# Altium schematic sheet ADC.SchDoc
size A4; DocumentNumber: 3; SheetNumber: 3; SheetTotal: 4
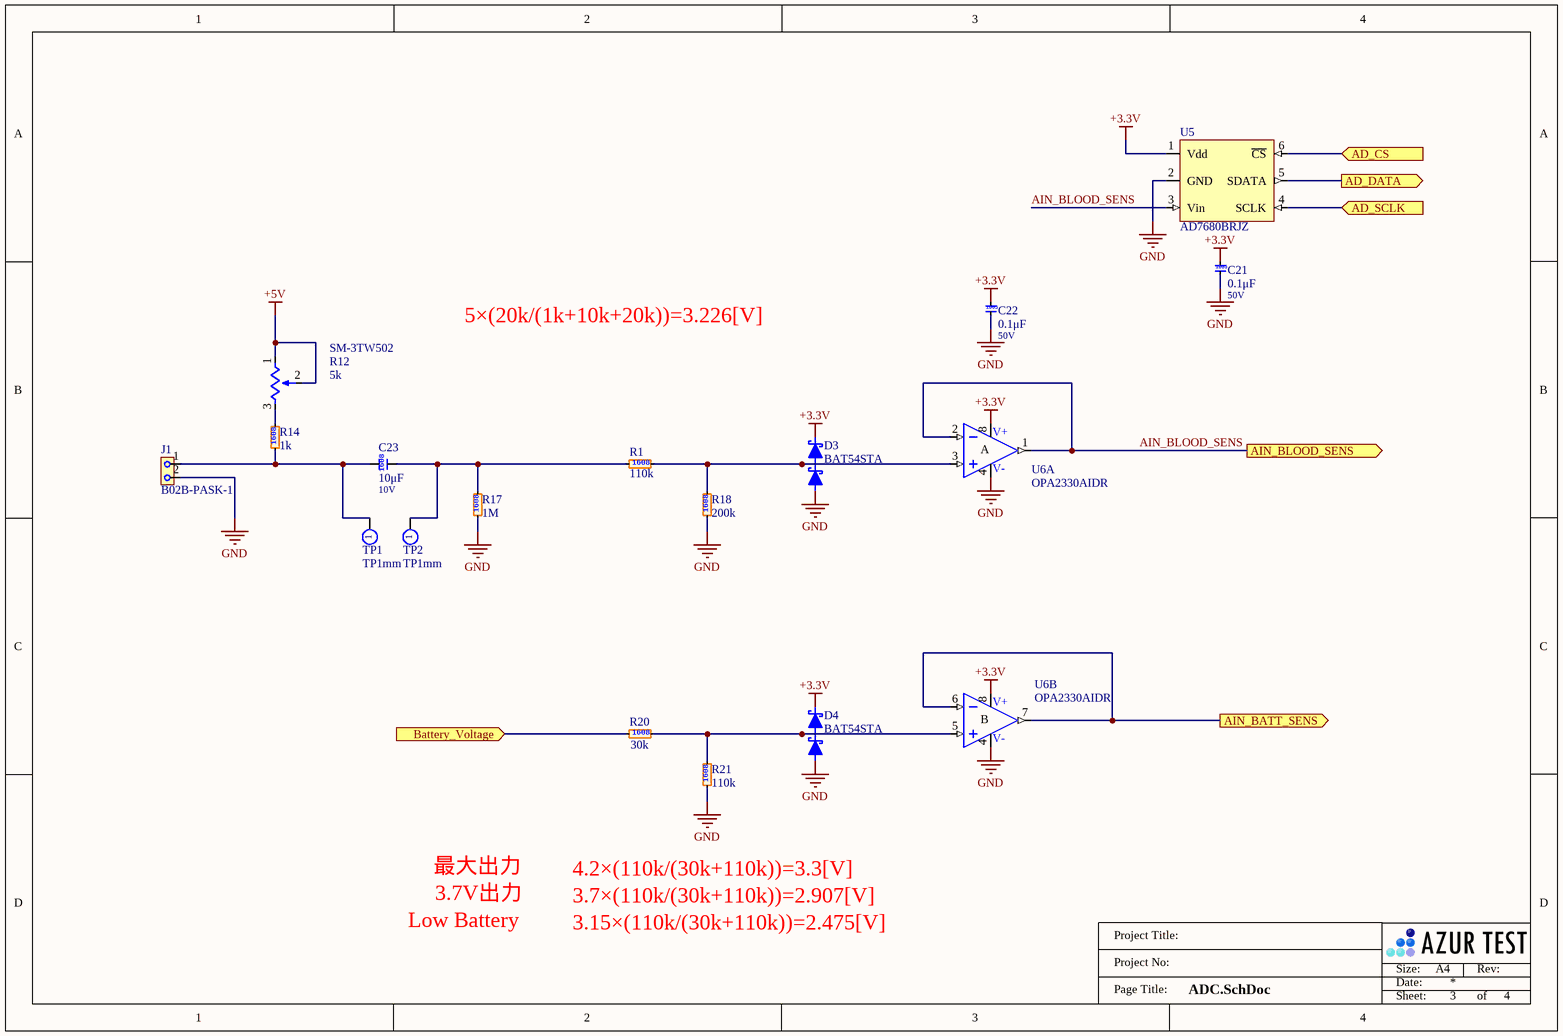
[diagram p0: ADC.SchDoc]

## Parts
C21  Tag: 0.1μF  Voltage: 50V  [C1005]  (hidden comment: GRM1552C1H101J)
C22  Tag: 0.1μF  Voltage: 50V  [C1005]  (hidden comment: GRM1552C1H101J)
C23  Tag: 10μF  Voltage: 10V  [C1608]  (hidden comment: C1608X5R1A106M080AC)
D3  BAT54STA  [SOT-23]
D4  BAT54STA  [SOT-23]
J1  B02B-PASK-1  [B02B-PASK-1]
R1  Tag: 110k  [R1608]  (hidden comment: RG1608P-114-B-T5)
R12  SM-3TW502  Tag: 5k  [SM-3TW]
R14  Tag: 1k  [R1608]  (hidden comment: RG1608P-102-B-T5)
R17  Tag: 1M  [R1608]  (hidden comment: RT0603DRD071ML)
R18  Tag: 200k  [R1608]  (hidden comment: RG1608P-204-B-T5)
R20  Tag: 30k  [R1608]  (hidden comment: RG1608P-303-B-T5)
R21  Tag: 110k  [R1608]  (hidden comment: RG1608P-114-B-T5)
TP1  TP1mm  [TP1mm]  (no BOM)
TP2  TP1mm  [TP1mm]  (no BOM)
U5  AD7680BRJZ  [SOT-23-6]
U6  OPA2330AIDR  [SOIC8_3.9mm]  (parts A,B of 2)

## Ports
AD_CS (in), AD_DATA (out), AD_SCLK (in), AIN_BATT_SENS (out), AIN_BLOOD_SENS (out), Battery_Voltage (in)

## Nets
+3.3V: C21.2 C22.2 D3.2(K) D4.2(K) U5.1(Vdd) U6.8(V+)
+5V: R12.1 R12.2
GND: C21.1 C22.1 D3.1(A) D4.1(A) J1.2 R17.1 R18.1 R21.1 U5.2(GND) U6.4(V-)
AD_CS: U5.6(~{CS}) ; port AD_CS
AD_DATA: U5.5(SDATA) ; port AD_DATA
AD_SCLK: U5.4(SCLK) ; port AD_SCLK
AIN_BATT_SENS: U6.6(IN-) U6.7(OUT) ; port AIN_BATT_SENS
AIN_BLOOD_SENS: U5.3(Vin) U6.1(OUT) U6.2(IN-) ; port AIN_BLOOD_SENS
Battery_Voltage: R20.1 ; port Battery_Voltage
NetC23_1: C23.1 R1.1 R17.2 TP2.1
NetC23_2: C23.2 J1.1 R14.1 TP1.1
NetD3_3: D3.3(C) R1.2 R18.2 U6.3(IN+)
NetD4_3: D4.3(C) R20.2 R21.2 U6.5(IN+)
NetR12_3: R12.3 R14.2

## Notes on the sheet
- 5×(20k/(1k+10k+20k))=3.226[V]
- 最大出力
- 3.7V出力
- 4.2×(110k/(30k+110k))=3.3[V]
- 3.7×(110k/(30k+110k))=2.907[V]
- Low Battery
- 3.15×(110k/(30k+110k))=2.475[V]
- Project Title:
- Project No:
- Size:
- Date:
- A4
- Rev:
- Page Title:
- Sheet:
- of
- (in symbol C1005) 1005
- (in symbol C1608) 1608
- (in symbol MF1608) 1608
- (in symbol OPA2330AIDR, part A) A
- (in symbol OPA2330AIDR, part B) B

## Library data of the parts
C21 C22 = C1005: セラコン1005サイズ; Vendor: murata
C23 = C1608: セラコン1608サイズ; Vendor: TDK Corporation
D3 D4 = BAT54S: ダブル直列ショットキー; Vendor: Fairchild
J1 = B02B-PASK-1: 雄,ストレート,1列2ピン; Vendor: JST
R1 R14 R18 R20 R21 = MF1608: 薄膜チップ抵抗1608サイズ; Vendor: susumu
R12 = SM-3TW***: CERMET TRIMMER 11 turns Top adjustmet; Vendor: Copal
R17 = MF1608: 薄膜チップ抵抗1608サイズ; Vendor: Yageo
TP1 TP2 = TP1mm: Test-Point 1mm
U5 = AD7680BRJZ: 16bit ADC 2.5V～5.5V SOT23; Vender: Analog Devices
U6 = OPA2330AIDR: CMOS ゼロドリフトアンプ 2回路 レールツーレール 8SOIC; Vendor: Texas Instruments